# Altium schematic sheet Parasite.SchDoc: Magsound
size A2; Date: 2022/7/5; Author: Donghui Dai; CompanyName: Tagsys; DrawnBy: Donghui Dai; Engineer: Donghui Dai; Organization: Tagsys; DocumentNumber: 1; SheetNumber: 1; SheetTotal: 1; PageSetup: Record=PageOptions|CenterHorizontal=True|CenterVertical=True|PrintScale=0.64|XCorrection=1.00|YCorrection=1.00|PrintKind=0|BorderSize=5000000|LeftOffset=0|BottomOffset=0|Orientation=2|PaperLength=1000|PaperWidth=1000|Scale=100|PaperSource=15|PrintQuality=600|MediaType=1|DitherType=10|PrintScaleMode=1|PaperKind=Letter; CurrentTime: Not shown in title block; CurrentDate: Not shown in title block; DocumentFullPathAndName: Not shown in title block; DocumentName: Not shown in title block; ModifiedDate: Not shown in title block
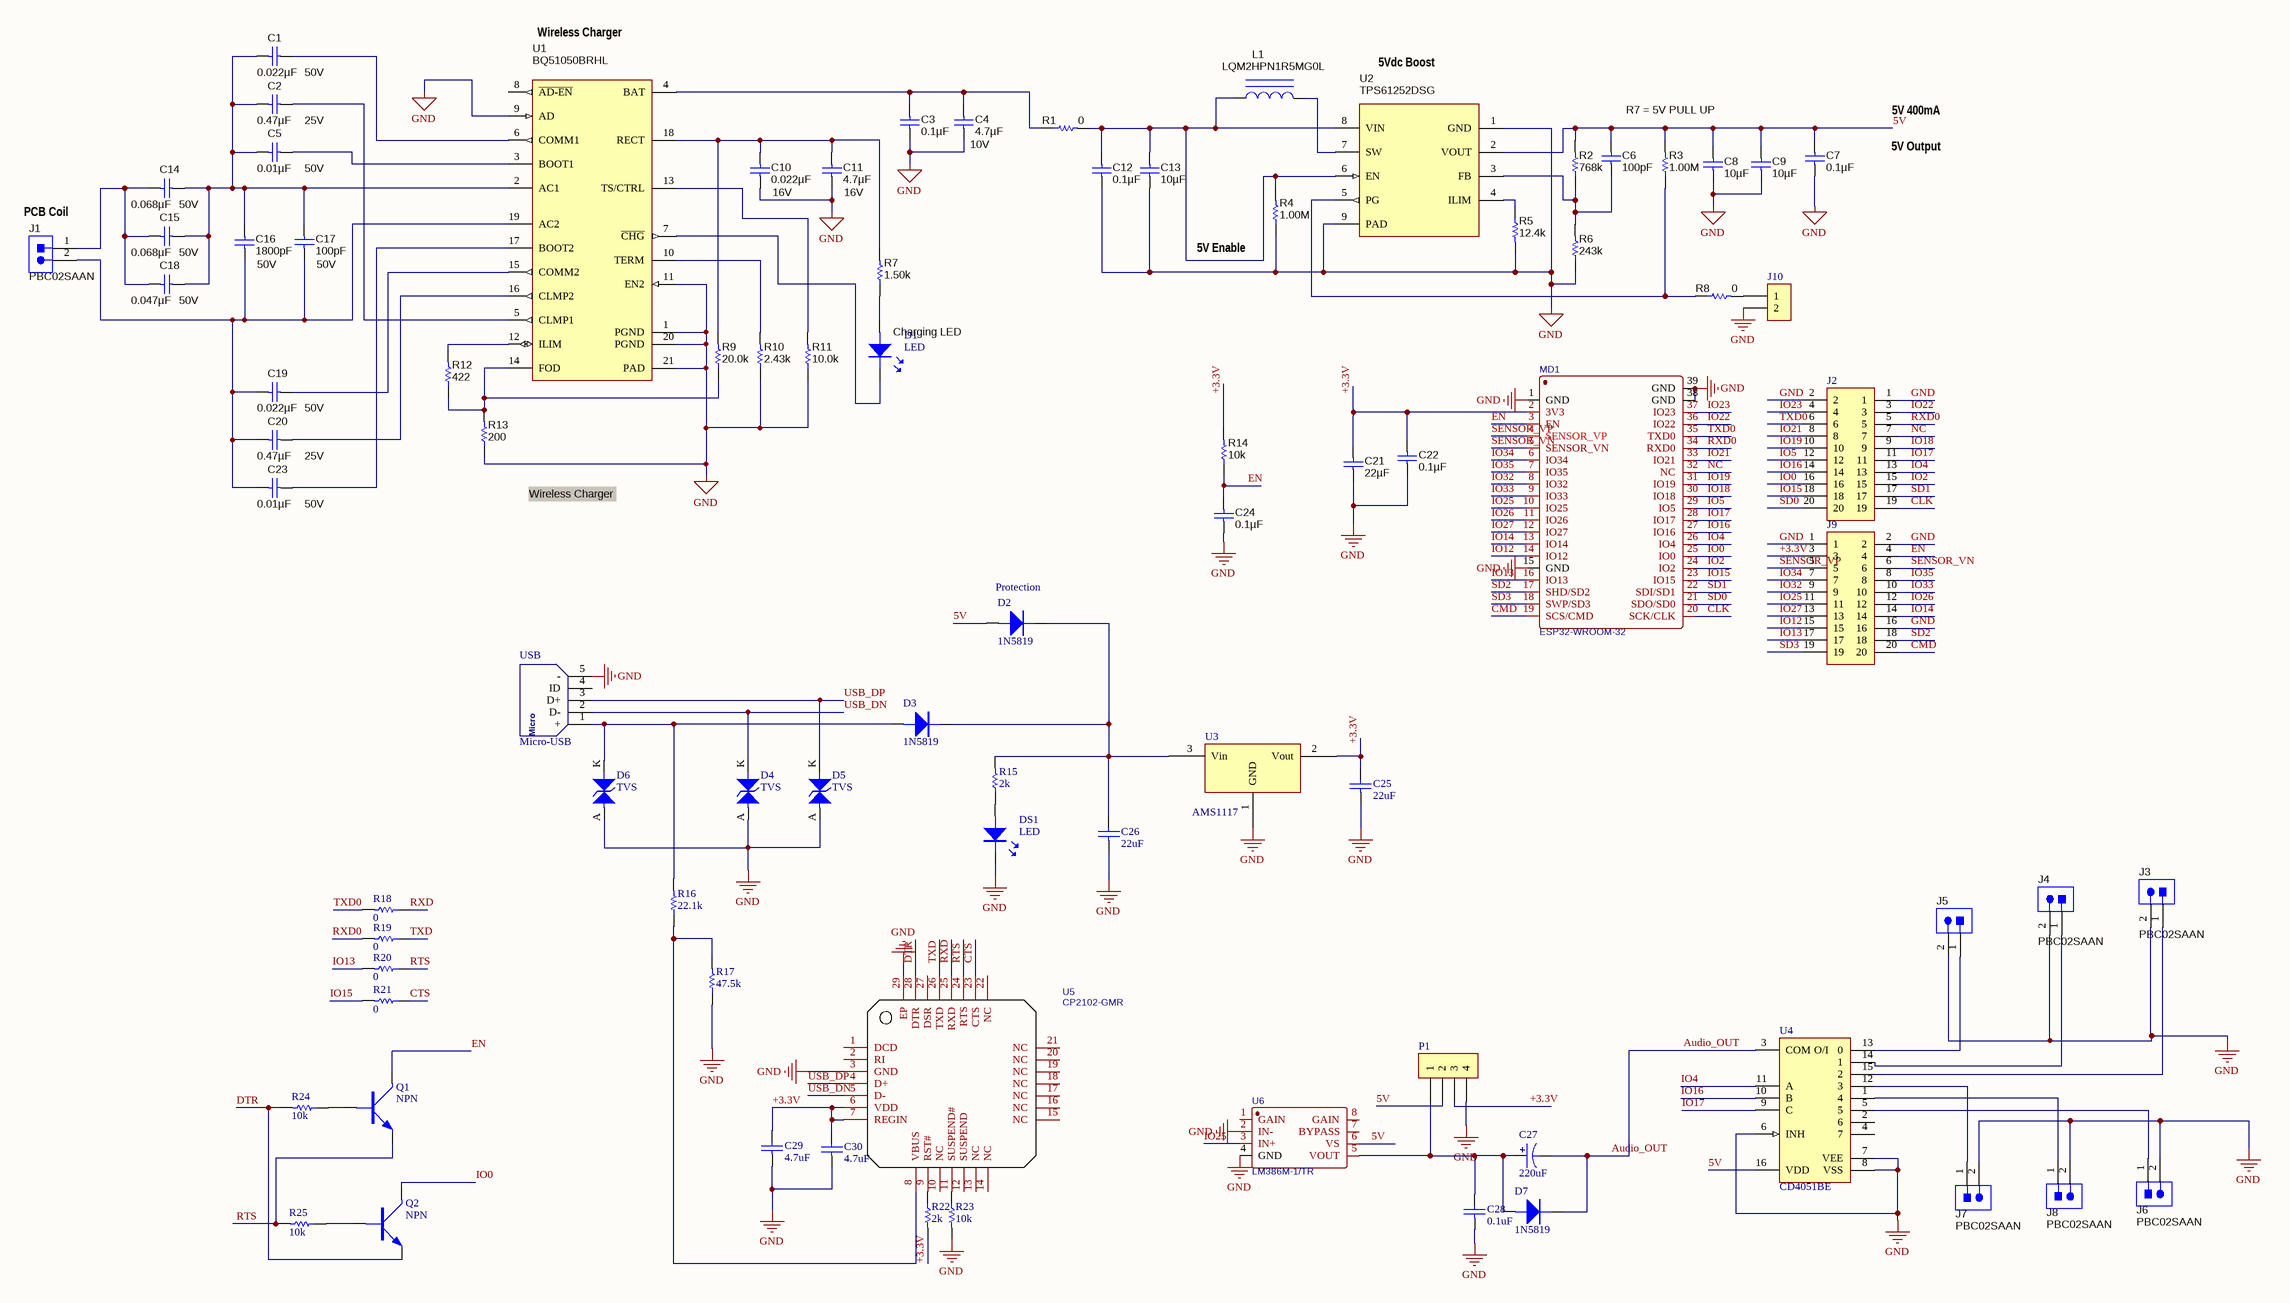
[diagram p0: Parasite.SchDoc]

## Parts
C1  ValueDisplayed: 0.022µF  Value2: 50V  [0603C]  (hidden comment: GRM155R71H223KA12D)
C2  ValueDisplayed: 0.47µF  Value2: 25V  [0603C]
C3  ValueDisplayed: 0.1µF  [0603C]  (hidden comment: GRM155R71A104KA01D)
C4  ValueDisplayed: 4.7µF  Value2: 10V  [0603C]  (hidden comment: C1005X5R1A475K050BC)
C5  ValueDisplayed: 0.01µF  Value2: 50V  [0603C]
C6  ValueDisplayed: 100pF  [0603C]  (hidden comment: CC0402JRNPO9BN101)
C7  ValueDisplayed: 0.1µF  [0603C]  (hidden comment: GRM155R71A104KA01D)
C8  ValueDisplayed: 10µF  [0603C]  (hidden comment: C0603C106M9PACTU)
C9  ValueDisplayed: 10µF  [0603C]  (hidden comment: C0603C106M9PACTU)
C10  ValueDisplayed: 0.022µF  Value2: 16V  [0603C]  (hidden comment: C1005X7R1C223K)
C11  ValueDisplayed: 4.7µF  Value2: 16V  [0603C]  (hidden comment: GRM188R61C475KAAJ)
C12  ValueDisplayed: 0.1µF  [0603C]  (hidden comment: GRM155R71A104KA01D)
C13  ValueDisplayed: 10µF  [0603C]  (hidden comment: C0603C106M9PACTU)
C14  ValueDisplayed: 0.068µF  Value2: 50V  [0603C]  (hidden comment: C1005X7R1H683K)
C15  ValueDisplayed: 0.068µF  Value2: 50V  [0603C]  (hidden comment: C1005X7R1H683K)
C16  ValueDisplayed: 1800pF  Value2: 50V  [0603C]  (hidden comment: GRM1885C1H182JA01D)
C17  ValueDisplayed: 100pF  Value2: 50V  [0603C]  (hidden comment: CC0402JRNPO9BN101)
C18  ValueDisplayed: 0.047µF  Value2: 50V  [0603C]  (hidden comment: GRM188R71H473KA61D)
C19  ValueDisplayed: 0.022µF  Value2: 50V  [0603C]  (hidden comment: GRM155R71H223KA12D)
C20  ValueDisplayed: 0.47µF  Value2: 25V  [0603C]  (hidden comment: GRM188R71E474KA12D)
C21  ValueDisplayed: 22µF  [0603C]  (hidden comment: GRM155R71A104KA01D)
C22  ValueDisplayed: 0.1µF  [0603C]  (hidden comment: GRM155R71A104KA01D)
C23  ValueDisplayed: 0.01µF  Value2: 50V  [0603C]  (hidden comment: C0402C103J5RACTU)
C24  ValueDisplayed: 0.1µF  [0603C]  (hidden comment: GRM155R71A104KA01D)
C25  22uF  [0603C]
C26  22uF  [0603C]
C27  220uF  [TAJ-B/3528]
C28  0.1uF  [0603C]
C29  4.7uF  [0603C]
C30  4.7uF  [0603C]
D1  LED  [LED-0603G]
D2  1N5819  [SOD-123]
D3  1N5819  [SOD-123]
D4  TVS  [SOD-523]
D5  TVS  [SOD-523]
D6  TVS  [SOD-523]
D7  1N5819  [SOD-123]
DS1  LED  [LED-0603B]
J1  PBC02SAAN  [Pin HDR1X2/2.54mm-S]
J2  (no value)  [Pin HDR2X10/2.54mm-S]
J3  PBC02SAAN  [Pin HDR1X2/2.54mm-S]
J4  PBC02SAAN  [Pin HDR1X2/2.54mm-S]
J5  (no value)  [Pin HDR1X2/2.54mm-S]
J6  PBC02SAAN  [Pin HDR1X2/2.54mm-S]
J7  PBC02SAAN  [Pin HDR1X2/2.54mm-S]
J8  PBC02SAAN  [Pin HDR1X2/2.54mm-S]
J9  (no value)  [Pin HDR2X10/2.54mm-S]
J10  (no value)  [Pin HDR1X2/2.54mm-S]
L1  LQM2HPN1R5MG0L  [L1008]
MD1  ESP32-WROOM-32  [WIFIM-SMD_ESP-32S]
P1  (no value)  [Pin HDR1X4/2.54mm-S]
Q1  NPN  [SOT-23]
Q2  NPN  [SOT-23]
R1  ValueDisplayed: 0  [0603R]  (hidden comment: CRCW04020000Z0ED)
R2  ValueDisplayed: 768k  [0603R]  (hidden comment: CRCW0402768KFKED)
R3  ValueDisplayed: 1.00M  [0603R]  (hidden comment: CRCW04021M00FKED)
R4  ValueDisplayed: 1.00M  [0603R]  (hidden comment: CRCW04021M00FKED)
R5  ValueDisplayed: 12.4k  [0603R]  (hidden comment: CRCW040212K4FKED)
R6  ValueDisplayed: 243k  [0603R]  (hidden comment: CRCW0402243KFKED)
R7  ValueDisplayed: 1.50k  [0603R]  (hidden comment: CRCW04021K50FKED)
R8  ValueDisplayed: 0  [0603R]  (hidden comment: CRCW04020000Z0ED)
R9  ValueDisplayed: 20.0k  [0603R]  (hidden comment: CRCW040220K0FKED)
R10  ValueDisplayed: 2.43k  [0603R]  (hidden comment: CRCW04022K43FKED)
R11  ValueDisplayed: 10.0k  [0603R]  (hidden comment: CRCW040210K0FKED)
R12  ValueDisplayed: 422  [0603R]
R13  ValueDisplayed: 200  [0603R]
R14  10k  [0603R]
R15  2k  [0603R]
R16  22.1k  [0603R]
R17  47.5k  [0603R]
R18  0  [0603R]
R19  0  [0603R]
R20  0  [0603R]
R21  0  [0603R]
R22  2k  [0603R]
R23  10k  [0603R]
R24  10k  [0603R]
R25  10k  [0603R]
U1  BQ51050BRHL  [QFN-20_L4.7-W3.7-P0.50-BL-EP]
U2  TPS61252DSG  [WSON-8_L2.0-W2.0-P0.65-BL-EP]
U3  AMS1117  [SOT223]
U4  CD4051BE  [DIP16]
U5  CP2102-GMR  [WQFN-28_L5.0-W5.0-P0.50-BL-EP3.2]
U6  LM386M-1/TR  [SOP-8_L5.0-W4.0-P1.27-LS6.0-BL]
USB  Micro-USB  [USB-micro_B]

## Nets
GND: C3.2 C4.2 C7.2 C8.2 C9.2 C10.2 C11.2 C12.2 C13.2 C21.2 C22.2 C24.2 C25.1 C26.1 C28.1 C29.1 C30.1 D4.A D5.A D6.A DS1.K J2.1 J2.2 J3.2 J4.2 J5.2 J6.2 J7.2 J8.2 J9.1 J9.2 J9.16 J10.2 MD1.1(GND) MD1.15(GND) MD1.38(GND) MD1.39(GND) P1.4 R4.1 R5.2 R6.1 R10.1 R11.1 R13.1 R17.1 R23.2 U1.1(PGND) U1.9(AD) U1.11(EN2) U1.20(PGND) U1.21(PAD) U2.1(GND) U2.9(PAD) U3.1(GND) U4.6(INH) U4.7(VEE) U4.8(VSS) U5.3(GND) U5.29(EP) U6.2(IN-) U6.4(GND) USB.5(-)
5V: C6.1 C7.1 C8.1 C9.1 D2.A P1.2 R2.2 R3.2 U2.2(VOUT) U4.16(VDD) U6.6(VS)
+3.3V: C21.1 C22.1 C25.2 C29.2 C30.2 J9.3 MD1.2(3V3) P1.3 R14.2 R22.2 U3.2(Vout) U5.6(VDD) U5.7(REGIN)
Audio_OUT: C27.2 D7.K U4.3(COM_O/I)
CLK: J2.19 MD1.20(SCK/CLK)
CMD: J9.20 MD1.19(SCS/CMD)
CTS: R21.1 U5.23(CTS)
DTR: Q2.E R24.2 U5.28(DTR)
EN: C24.1 J9.4 MD1.3(EN) Q1.C R14.1
IO0: J2.16 MD1.25(IO0) Q2.C
IO2: J2.15 MD1.24(IO2)
IO4: J2.13 MD1.26(IO4) U4.11(A)
IO5: J2.12 MD1.29(IO5)
IO12: J9.15 MD1.14(IO12)
IO13: J9.17 MD1.16(IO13) R20.2
IO14: J9.14 MD1.13(IO14)
IO15: J2.18 MD1.23(IO15) R21.2
IO16: J2.14 MD1.27(IO16) U4.10(B)
IO17: J2.11 MD1.28(IO17) U4.9(C)
IO18: J2.9 MD1.30(IO18)
IO19: J2.10 MD1.31(IO19)
IO21: J2.8 MD1.33(IO21)
IO22: J2.3 MD1.36(IO22)
IO23: J2.4 MD1.37(IO23)
IO25: J9.11 MD1.10(IO25) U6.3(IN+)
IO26: J9.12 MD1.11(IO26)
IO27: J9.13 MD1.12(IO27)
IO32: J9.9 MD1.8(IO32)
IO33: J9.10 MD1.9(IO33)
IO34: J9.7 MD1.6(IO34)
IO35: J9.8 MD1.7(IO35)
NC: J2.7 MD1.32(NC)
RTS: Q1.E R20.1 R25.2 U5.24(RTS)
RXD: R18.1 U5.25(RXD)
RXD0: J2.5 MD1.34(RXD0) R19.2
SD0: J2.20 MD1.21(SDO/SD0)
SD1: J2.17 MD1.22(SDI/SD1)
SD2: J9.18 MD1.17(SHD/SD2)
SD3: J9.19 MD1.18(SWP/SD3)
SENSOR_VN: J9.6 MD1.5(SENSOR_VN)
SENSOR_VP: J9.5 MD1.4(SENSOR_VP)
TXD: R19.1 U5.26(TXD)
TXD0: J2.6 MD1.35(TXD0) R18.2
USB_DN: D4.K U5.5(D-) USB.2(D-)
USB_DP: D5.K U5.4(D+) USB.3(D+)
NetC1_1: C1.1 U1.6(COMM1)
NetC1_2: C1.2 C2.2 C5.2 C14.1 C15.1 C16.1 C17.2 C18.1 U1.2(AC1)
NetC2_1: C2.1 U1.5(CLMP1)
NetC3_1: C3.1 C4.1 R1.1 U1.4(BAT)
NetC5_1: C5.1 U1.3(BOOT1)
NetC6_2: C6.2 R2.1 R6.2 U2.3(FB)
NetC10_1: C10.1 C11.1 R7.2 R9.2 U1.18(RECT)
NetC12_1: C12.1 C13.1 L1.1 R1.2 R4.2 U2.6(EN) U2.8(VIN)
NetC14_2: C14.2 C15.2 C18.2 J1.1
NetC16_2: C16.2 C17.1 C19.2 C20.2 C23.2 J1.2 U1.19(AC2)
NetC19_1: C19.1 U1.15(COMM2)
NetC20_1: C20.1 U1.16(CLMP2)
NetC23_1: C23.1 U1.17(BOOT2)
NetC26_2: C26.2 D2.K D3.K R15.2 U3.3(Vin)
NetC27_1: C27.1 C28.2 D7.A P1.1 U6.5(VOUT)
NetD1_A: D1.A R7.1
NetD1_K: D1.K U1.7(~{CHG})
NetD3_A: D3.A D6.K R16.2 USB.1(+)
NetDS1_A: DS1.A R15.1
NetJ3_1: J3.1 U4.15(2)
NetJ4_1: J4.1 U4.14(1)
NetJ5_1: J5.1 U4.13(0)
NetJ6_1: J6.1 U4.5
NetJ7_1: J7.1 U4.12(3)
NetJ8_1: J8.1 U4.1(4)
NetJ10_1: J10.1 R8.2
NetL1_2: L1.2 U2.7(SW)
NetQ1_B: Q1.B R24.1
NetQ2_B: Q2.B R25.1
NetR3_1: R3.1 R8.1 U2.5(PG)
NetR5_1: R5.1 U2.4(ILIM)
NetR9_1: R9.1 R12.1 R13.2 U1.14(FOD)
NetR10_2: R10.2 U1.10(TERM)
NetR11_2: R11.2 U1.13(TS/CTRL)
NetR12_2: R12.2 U1.12(ILIM)
NetR16_1: R16.1 R17.2 U5.8(VBUS)
NetR22_1: R22.1 U5.9(RST#)
NetR23_1: R23.1 U5.11(SUSPEND#)

Not connected (* = marked no-connect by the designer): U1 8(~{AD-EN}); U4 2(6) 4(7); U5 1(DCD) 2(RI) 10(NC) 12(SUSPEND) 13(NC) 14(NC) 15(NC) 16(NC) 17(NC) 18(NC) 19(NC) 20(NC) 21(NC) 22(NC) 27(DSR); U6 1(GAIN) 7(BYPASS) 8(GAIN); USB 4(ID)

## Notes on the sheet
- Wireless Charger
- 5Vdc Boost
- R7 = 5V PULL UP
- 5V Output
- 5V 400mA
- (near J1) PCB Coil
- (near R4) 5V Enable
- (near D1) Charging LED
- (near D2) Protection
- Title
- Size:
- Date:
- File:
- A2
- Number:
- Time:
- Revision:
- Sheet
- of
- (in symbol Micro-USB) Micro

## Library data of the parts
C1 C19 = GRM155R71H223KA12D: CAP, CERM, 0.022 µF, 50 V, +/- 10%, X7R, 0402; Manufacturer: MuRata; Polarized: N; CompType: Capacitor; Value: 0.022uF; U/M: EA; Cap_F: 0.000000022; Tolerance_%: 10; Value1: Unknown; VDC_V: 50; TaMin_C: -55; TaMax_C: 125; Cap_Case: 0402; SymbolVersion: 2008-07-09; PartNumber: GRM155R71H223KA12D; PackageReference: 0402; RoHS: Y; MountType: SMT; Technology: Ceramic; TempCo: X7R; Published: 2008-06-19; Publisher: Texas Instruments; LatestRevisionDate: 2015-07-30; ComponentLink1Description: Datasheet link; ComponentLink1URL: http://search.murata.co.jp/Ceramy/PnsearchViewAction.do?HnOFG=ON&HnNFG=ON&SEL_CNT=50&sLang=en&sKey=GRM155R71H223KA12D&x=9&y=9&search=startwith; Supplier 1: Digi-Key; Supplier Part Number 1: 490-3884-1-ND; Supplier 2: Mouser; Supplier Part Number 2: 81-GRM155R71H223KA12; Supplier 3: Farnell; Supplier Part Number 3: 1828888
C2 C20 = GRM188R71E474KA12D: CAP, CERM, 0.47 µF, 25 V, +/- 10%, X7R, 0603; Manufacturer: MuRata; Polarized: N; CompType: Capacitor; Value: 0.47uF; U/M: EA; Cap_F: 0.00000047; Tolerance_%: 10; Value1: Unknown; VDC_V: 25; TaMin_C: -55; TaMax_C: 125; Cap_Case: 0603; SymbolVersion: 2008-07-09; PartNumber: GRM188R71E474KA12D; PackageReference: 0603; RoHS: Y; MountType: SMT; Technology: Ceramic; TempCo: X7R; Published: 2008-06-19; Publisher: Texas Instruments; LatestRevisionDate: 2015-07-30; ComponentLink1Description: Datasheet link; ComponentLink1URL: http://search.murata.co.jp/Ceramy/PnsearchViewAction.do?HnOFG=ON&HnNFG=ON&SEL_CNT=50&sLang=en&sKey=GRM188R71E474KA12D&x=9&y=9&search=startwith; Supplier 1: Digi-Key; Supplier Part Number 1: 490-3291-1-ND; Supplier 2: Mouser; Supplier Part Number 2: 81-GRM188R71E474KA12; Supplier 3: Farnell; Supplier Part Number 3: 1828901
C3 C7 C12 C21 C22 C24 = GRM155R71A104KA01D: CAP, CERM, 0.1 µF, 10 V, +/- 10%, X7R, 0402; Manufacturer: MuRata; Polarized: N; CompType: Capacitor; Value: 0.1uF; U/M: EA; Cap_F: 0.0000001; Tolerance_%: 10; Value1: Unknown; Value2: 10V; TaMin_C: -55; TaMax_C: 125; Cap_Case: 0402; SymbolVersion: 2008-07-09; PartNumber: GRM155R71A104KA01D; PackageReference: 0402; RoHS: Y; VDC_V: 10; MountType: SMT; Technology: Ceramic; TempCo: X7R; Published: 2008-06-19; Publisher: Texas Instruments; LatestRevisionDate: 2015-07-30; ComponentLink1Description: Datasheet link; ComponentLink1URL: http://search.murata.co.jp/Ceramy/PnsearchViewAction.do?HnOFG=ON&HnNFG=ON&SEL_CNT=50&sLang=en&sKey=GRM155R71A104KA01D&x=9&y=9&search=startwith; Supplier 1: Digi-Key; Supplier Part Number 1: GRM155R71A104KA01D-ND; Supplier 2: Mouser; Supplier Part Number 2: 81-GRM155R71A104KA1D; Supplier 3: Farnell; Supplier Part Number 3: 1828860
C4 = C1005X5R1A475K050BC: CAP, CERM, 4.7 µF, 10 V, +/- 10%, X5R, 0402; Manufacturer: TDK; Polarized: N; CompType: Capacitor; Value: 4.7uF; U/M: EA; Cap_F: 0.0000047; Tolerance_%: 10; Value1: Unknown; TaMin_C: -55; TaMax_C: 85; Cap_Case: 0402; SymbolVersion: 2008-07-09; PartNumber: C1005X5R1A475K050BC; PackageReference: 0402; RoHS: Y; VDC_V: 10; MountType: SMT; Technology: Ceramic; TempCo: X5R; Published: 2008-06-19; Publisher: Texas Instruments; LatestRevisionDate: 2015-07-30; ComponentLink1Description: Datasheet link; ComponentLink1URL: http://product.tdk.com/en/catalog/datasheets/mlcc_commercial_general_en.pdf; Supplier 1: Digi-Key; Supplier Part Number 1: 445-13820-1-ND; Supplier 2: Mouser; Supplier Part Number 2: 810-C1005X5R1A475KBC
C5 C23 = C0402C103J5RACTU: CAP, CERM, 0.01 µF, 50 V, +/- 5%, X7R, 0402; Manufacturer: Kemet; Polarized: N; CompType: Capacitor; Value: 0.01uF; U/M: EA; Cap_F: 0.00000001; Tolerance_%: 5; Value1: Unknown; VDC_V: 50; TaMin_C: -55; TaMax_C: 125; Cap_Case: 0402; SymbolVersion: 2008-07-09; PartNumber: C0402C103J5RACTU; PackageReference: 0402; RoHS: Y; MountType: SMT; Technology: Ceramic; TempCo: X7R; Published: 2008-06-19; Publisher: Texas Instruments; LatestRevisionDate: 2015-07-30; ComponentLink1Description: Datasheet link; ComponentLink1URL: http://www.kemet.com/Lists/ProductCatalog/Attachments/53/KEM_C1002_X7R_SMD.pdf; Supplier 1: Digi-Key; Supplier Part Number 1: 399-7758-1-ND; Supplier 2: Mouser; Supplier Part Number 2: 80-C0402C103J5R; Supplier 3: Farnell; Supplier Part Number 3: 2413922
C6 = CC0402JRNPO9BN101: CAP, CERM, 100 pF, 50 V, +/- 5%, C0G/NP0, 0402; Manufacturer: Yageo America; Polarized: N; CompType: Capacitor; Value: 100pF; U/M: EA; Cap_F: 0.0000000001; Tolerance_%: 5; Value1: Unknown; VDC_V: 50; Value2: 50V; TaMin_C: -55; TaMax_C: 125; Cap_Case: 0402; SymbolVersion: 2008-07-09; PartNumber: CC0402JRNPO9BN101; PackageReference: 0402; RoHS: Y; MountType: SMT; Technology: Ceramic; TempCo: C0G/NP0; Published: 2008-06-19; Publisher: Texas Instruments; LatestRevisionDate: 2015-07-30; ComponentLink1Description: Datasheet link; ComponentLink1URL: http://www.yageo.com/documents/recent/UPY-GP_NP0_16V-to-50V_10.pdf; Supplier 1: Digi-Key; Supplier Part Number 1: 311-1024-1-ND; Supplier 2: Mouser; Supplier Part Number 2: 603-CC402JRNPO9BN101; Supplier 3: Farnell; Supplier Part Number 3: 3019226
C8 C9 C13 = C0603C106M9PACTU: CAP, CERM, 10 µF, 6.3 V, +/- 20%, X5R, 0603; Manufacturer: Kemet; Polarized: N; CompType: Capacitor; Value: 10uF; U/M: EA; Cap_F: 0.00001; Tolerance_%: 20; ESR_ohm: 0.004; Value1: 0.004 ohm; VDC_V: 6.3; Value2: 6.3V; IRMS_A: 8.9; TaMin_C: -55; TaMax_C: 85; Cap_Case: 0603; SymbolVersion: 2008-07-09; PartNumber: C0603C106M9PACTU; PackageReference: 0603; RoHS: Y; MountType: SMT; Technology: Ceramic; TempCo: X5R; Published: 2008-06-19; Publisher: Texas Instruments; LatestRevisionDate: 2015-07-30; ComponentLink1Description: Datasheet link; ComponentLink1URL: http://www.kemet.com/kemet/web/homepage/kechome.nsf/vapubfiles/F3102_Y5V.pdf/$file/F3102_Y5V.pdf; Supplier 1: Digi-Key; Supplier Part Number 1: 399-5504-1-ND; Supplier 2: Mouser; Supplier Part Number 2: 80-C0603C106M9P; Supplier 3: Farnell; Supplier Part Number 3: 1288201
C10 = C1005X7R1C223K: CAP, CERM, 0.022 µF, 16 V, +/- 10%, X7R, 0402; Manufacturer: TDK; Polarized: N; CompType: Capacitor; Value: 0.022uF; U/M: EA; Cap_F: 0.000000022; Tolerance_%: 10; ESR_ohm: 0.0419; Value1: 0.0419 ohm; VDC_V: 16; TaMin_C: -55; TaMax_C: 125; Cap_Case: 0402; SymbolVersion: 2008-07-09; PartNumber: C1005X7R1C223K; PackageReference: 0402; RoHS: Y; MountType: SMT; Technology: Ceramic; TempCo: X7R; Published: 2008-06-19; Publisher: Texas Instruments; LatestRevisionDate: 2015-07-30; ComponentLink1Description: Datasheet link; ComponentLink1URL: http://www.tdk.co.jp/tefe02/e412_c.pdf; Supplier 1: Digi-Key; Supplier Part Number 1: 445-1263-1-ND; Supplier 2: Farnell; Supplier Part Number 2: 1844128
C11 = GRM188R61C475KAAJ: CAP, CERM, 4.7 µF, 16 V, +/- 10%, X5R, 0603; Manufacturer: MuRata; Polarized: N; CompType: Capacitor; Value: 4.7uF; U/M: EA; Cap_F: 0.0000047; Tolerance_%: 10; Value1: Unknown; VDC_V: 16; TaMin_C: -55; TaMax_C: 85; Cap_Case: 0603; SymbolVersion: 2008-07-09; PartNumber: GRM188R61C475KAAJ; PackageReference: 0603; RoHS: Y; MountType: SMT; Technology: Ceramic; TempCo: X5R; Published: 2008-06-19; Publisher: Texas Instruments; LatestRevisionDate: 2015-07-30; ComponentLink1Description: Datasheet link; ComponentLink1URL: http://psearch.murata.com/capacitor/product/GRM188R61C475KAAJ%23.pdf
C14 C15 = C1005X7R1H683K: CAP, CERM, 0.068 µF, 50 V, +/- 10%, X7R, 0402; Manufacturer: TDK; Polarized: N; CompType: Capacitor; Value: 0.068uF; U/M: EA; Cap_F: 0.000000068; Tolerance_%: 10; Value1: Unknown; VDC_V: 50; TaMin_C: -55; TaMax_C: 125; Cap_Case: 0402; SymbolVersion: 2008-07-09; PartNumber: C1005X7R1H683K; PackageReference: 0402; RoHS: Y; MountType: SMT; Technology: Ceramic; TempCo: X7R; Published: 2008-06-19; Publisher: Texas Instruments; LatestRevisionDate: 2015-07-30; ComponentLink1Description: Datasheet link; Supplier 1: Digi-Key; Supplier Part Number 1: 445-5930-1-ND; Supplier 2: Farnell; Supplier Part Number 2: 1844144
C16 = GRM1885C1H182JA01D: CAP, CERM, 1800 pF, 50 V, +/- 5%, C0G/NP0, 0603; Manufacturer: MuRata; Polarized: N; CompType: Capacitor; Value: 1800pF; U/M: EA; Cap_F: 0.0000000018; Tolerance_%: 5; Value1: Unknown; VDC_V: 50; TaMin_C: -55; TaMax_C: 125; Cap_Case: 0603; SymbolVersion: 2008-07-09; PartNumber: GRM1885C1H182JA01D; PackageReference: 0603; RoHS: Y; MountType: SMT; Technology: Ceramic; TempCo: C0G/NP0; Published: 2008-06-19; Publisher: Texas Instruments; LatestRevisionDate: 2015-07-30; ComponentLink1Description: Datasheet link; ComponentLink1URL: http://search.murata.co.jp/Ceramy/PnsearchViewAction.do?HnOFG=ON&HnNFG=ON&SEL_CNT=50&sLang=en&sKey=GRM1885C1H182JA01D&x=9&y=9&search=startwith; Supplier 1: Digi-Key; Supplier Part Number 1: 490-1457-1-ND; Supplier 2: Mouser; Supplier Part Number 2: 81-GRM1885C1H182JA01
C17 = CC0402JRNPO9BN101: CAP, CERM, 100 pF, 50 V, +/- 5%, C0G/NP0, 0402; Manufacturer: Yageo America; Polarized: N; CompType: Capacitor; Value: 100pF; U/M: EA; Cap_F: 0.0000000001; Tolerance_%: 5; Value1: Unknown; VDC_V: 50; TaMin_C: -55; TaMax_C: 125; Cap_Case: 0402; SymbolVersion: 2008-07-09; PartNumber: CC0402JRNPO9BN101; PackageReference: 0402; RoHS: Y; MountType: SMT; Technology: Ceramic; TempCo: C0G/NP0; Published: 2008-06-19; Publisher: Texas Instruments; LatestRevisionDate: 2015-07-30; ComponentLink1Description: Datasheet link; ComponentLink1URL: http://www.yageo.com/documents/recent/UPY-GP_NP0_16V-to-50V_10.pdf; Supplier 1: Digi-Key; Supplier Part Number 1: 311-1024-1-ND; Supplier 2: Mouser; Supplier Part Number 2: 603-CC402JRNPO9BN101; Supplier 3: Farnell; Supplier Part Number 3: 3019226
C18 = GRM188R71H473KA61D: CAP, CERM, 0.047 µF, 50 V, +/- 10%, X7R, 0603; Manufacturer: MuRata; Polarized: N; CompType: Capacitor; Value: 0.047uF; U/M: EA; Cap_F: 0.000000047; Tolerance_%: 10; Value1: Unknown; VDC_V: 50; TaMin_C: -55; TaMax_C: 125; Cap_Case: 0603; SymbolVersion: 2008-07-09; PartNumber: GRM188R71H473KA61D; PackageReference: 0603; RoHS: Y; MountType: SMT; Technology: Ceramic; TempCo: X7R; Published: 2008-06-19; Publisher: Texas Instruments; LatestRevisionDate: 2015-07-30; ComponentLink1Description: Datasheet link; ComponentLink1URL: http://search.murata.co.jp/Ceramy/PnsearchViewAction.do?HnOFG=ON&HnNFG=ON&SEL_CNT=50&sLang=en&sKey=GRM188R71H473KA61D&x=9&y=9&search=startwith; Supplier 1: Digi-Key; Supplier Part Number 1: 490-3287-1-ND; Supplier 2: Mouser; Supplier Part Number 2: 81-GRM188R71H473KA61; Supplier 3: Farnell; Supplier Part Number 3: 8820015
C25 C26 C28-C30 = CAP: 无极性电容
C27 = TCAP: 钽电容
D2 D3 D7 = DIODE: 普通二极管
D4-D6 = TVS: 双向瞬态抑制二极管
J1 J3-J8 = PBC02SAAN: Header, 100mil, 2x1, Gold, TH; Manufacturer: Sullins Connector Solutions; SymbolCreator: a0412235; U/M: EA; SymbolVersion: 2013-10-31; PartNumber: PBC02SAAN; PackageReference: Sullins 100mil, 1x2, 230 mil above insulator; ClassName: Header; CompType: Header; RoHS: Y; MountType: TH; ComponentLink1Description: Datasheet Link; ComponentLink1URL: http://www.sullinscorp.com/catalogs/97_Page78-79_HEADER_.100_2.54mm_MALE_BREAKAWAY.pdf; Publisher: Texas Instruments; LatestRevisionDate: 2015-07-24; Supplier 1: Digi-Key; Supplier Part Number 1: S1011E-02-ND
J2 J9 = Pin HDR2X10
J10 = Pin HDR1X2
L1 = LQM2HPN1R5MG0L: Inductor, Multilayer, Ferrite, 1.5 µH, 1.5 A, 0.07 ohm, SMD; Manufacturer: MuRata; Value: 1.5uH; Ind_H: 1.5E-6; ValueDisplayed: 1.5µH; Imax_A: 1.5; Irms: 1.5A @ 40C rise; DCR_ohm: 0.07; Value2: 1.5A; SymbolVersion: 2008-07-23; CompType: Inductor; PartNumber: LQM2HPN1R5MG0L; Value1: 0.07 ohm; Technology: Multilayer; MountType: SMT; Material: Ferrite; PackageReference: SMD, Body 2.5x2mm, Height 1.2mm; Published: 2008-06-26; Publisher: Texas Instruments; LatestRevisionDate: 2015-07-10; ComponentLink1Description: Datasheet link; ComponentLink1URL: http://psearch.murata.com/inductor/product/LQM2HPN1R5MG0%23.pdf; RoHS: Y; Supplier 1: Digi-Key; Supplier Part Number 1: 490-5113-1-ND; Supplier 2: Mouser; Supplier Part Number 2: 81-LQM2HPN1R5MG0L
MD1 = ESP32-WROOM-32: BOM_Manufacturer: Espressif Systems; Contributor: LCSC; BOM_Supplier: LCSC; BOM_Supplier Part: C82899; BOM_Manufacturer Part: ESP32-WROOM-32; BOM_JLCPCB Part Class: Extended Part; spicePre: U; spiceSymbolName: ESP32-WROOM-32
P1 = Pin HDR1X4
Q1 Q2 = NPN: NPN三极管
R1 R8 = CRCW04020000Z0ED: RES, 0, 5%, 0.063 W, 0402; Manufacturer: Vishay-Dale; CompType: Resistor; Value: 0; Value_Code: 0000; Tolerance_%: 5; Power_W: 0.063; Value2: 0.063W; VDC_V: 50; TempCo: 200 ppm/C; EIA_Code: E24; U/M: EA; SymbolVersion: 2009-05-29; PartNumber: CRCW04020000Z0ED; PackageReference: 0402; RoHS: Y; Res_ohm: 0; Value1: 5%; MountType: SMT; Technology: Thick Film; Published: 2008-06-26; Publisher: Texas Instruments; LatestRevisionDate: 2015-07-29; ComponentLink1Description: Datasheet link; ComponentLink1URL: http://www.vishay.com/docs/20035/dcrcwe3.pdf; Supplier 1: Digi-Key; Supplier Part Number 1: 541-0.0JCT-ND; Supplier 2: Mouser; Supplier Part Number 2: 71-CRCW0402-0-E3; Supplier 3: Farnell; Supplier Part Number 3: 1469661
R2 = CRCW0402768KFKED: RES, 768 k, 1%, 0.063 W, 0402; Manufacturer: Vishay-Dale; CompType: Resistor; Value: 768k; Res_ohm: 768000; Tolerance_%: 1; Power_W: 0.063; Value2: 0.063W; VDC_V: 50; TempCo: 100 ppm/C; EIA_Code: E96; U/M: EA; SymbolVersion: 2009-05-29; PartNumber: CRCW0402768KFKED; PackageReference: 0402; RoHS: Y; Value_Code: 768k; Value1: 1%; MountType: SMT; Technology: Thick Film; Published: 2008-06-26; Publisher: Texas Instruments; LatestRevisionDate: 2015-07-29; ComponentLink1Description: Datasheet link; ComponentLink1URL: http://www.vishay.com/docs/20035/dcrcwe3.pdf; Supplier 1: Digi-Key; Supplier Part Number 1: 541-768KLCT-ND; Supplier 2: Mouser; Supplier Part Number 2: 71-CRCW0402768KFKED; Supplier 3: Farnell; Supplier Part Number 3: 1151495
R3 R4 R14 = CRCW04021M00FKED: RES, 1.00 M, 1%, 0.063 W, 0402; Manufacturer: Vishay-Dale; CompType: Resistor; Value: 1.00Meg; Res_ohm: 1000000; Value_Code: 1M00; Tolerance_%: 1; Power_W: 0.063; Value2: 0.063W; VDC_V: 50; TempCo: 100 ppm/C; EIA_Code: E96; U/M: EA; SymbolVersion: 2009-05-29; PartNumber: CRCW04021M00FKED; PackageReference: 0402; RoHS: Y; Value1: 1%; MountType: SMT; Technology: Thick Film; Published: 2008-06-26; Publisher: Texas Instruments; LatestRevisionDate: 2015-07-29; ComponentLink1Description: Datasheet link; ComponentLink1URL: http://www.vishay.com/docs/20035/dcrcwe3.pdf; Supplier 1: Digi-Key; Supplier Part Number 1: 541-1.00MLCT-ND; Supplier 2: Mouser; Supplier Part Number 2: 71-CRCW0402-1.0M-E3; Supplier 3: Farnell; Supplier Part Number 3: 1469667
  R14: ValueDisplayed: 10k
R5 = CRCW040212K4FKED: RES, 12.4 k, 1%, 0.063 W, 0402; Manufacturer: Vishay-Dale; CompType: Resistor; Value: 12.4k; Res_ohm: 12400; Value_Code: 12k4; Tolerance_%: 1; Power_W: 0.063; Value2: 0.063W; VDC_V: 50; TempCo: 100 ppm/C; EIA_Code: E96; U/M: EA; SymbolVersion: 2009-05-29; PartNumber: CRCW040212K4FKED; PackageReference: 0402; RoHS: Y; Value1: 1%; MountType: SMT; Technology: Thick Film; Published: 2008-06-26; Publisher: Texas Instruments; LatestRevisionDate: 2015-07-29; ComponentLink1Description: Datasheet link; ComponentLink1URL: http://www.vishay.com/docs/20035/dcrcwe3.pdf; Supplier 1: Digi-Key; Supplier Part Number 1: 541-12.4KLCT-ND; Supplier 2: Mouser; Supplier Part Number 2: 71-CRCW0402-12.4K-E3; Supplier 3: Farnell; Supplier Part Number 3: 1652748
R6 = CRCW0402243KFKED: RES, 243 k, 1%, 0.063 W, 0402; Manufacturer: Vishay-Dale; CompType: Resistor; Value: 243k; Res_ohm: 243000; Tolerance_%: 1; Power_W: 0.063; Value2: 0.063W; VDC_V: 50; TempCo: 100 ppm/C; EIA_Code: E96; U/M: EA; SymbolVersion: 2009-05-29; PartNumber: CRCW0402243KFKED; PackageReference: 0402; RoHS: Y; Value_Code: 243k; Value1: 1%; MountType: SMT; Technology: Thick Film; Published: 2008-06-26; Publisher: Texas Instruments; LatestRevisionDate: 2015-07-29; ComponentLink1Description: Datasheet link; ComponentLink1URL: http://www.vishay.com/docs/20035/dcrcwe3.pdf; Supplier 1: Digi-Key; Supplier Part Number 1: 541-243KLCT-ND; Supplier 2: Mouser; Supplier Part Number 2: 71-CRCW0402-243K-E3; Supplier 3: Farnell; Supplier Part Number 3: 1151064
R7 = CRCW04021K50FKED: RES, 1.50 k, 1%, 0.063 W, 0402; Manufacturer: Vishay-Dale; CompType: Resistor; Value: 1.50k; Res_ohm: 1500; Value_Code: 1k50; Tolerance_%: 1; Power_W: 0.063; Value2: 0.063W; VDC_V: 50; TempCo: 100 ppm/C; EIA_Code: E96; U/M: EA; SymbolVersion: 2009-05-29; PartNumber: CRCW04021K50FKED; PackageReference: 0402; RoHS: Y; Value1: 1%; MountType: SMT; Technology: Thick Film; Published: 2008-06-26; Publisher: Texas Instruments; LatestRevisionDate: 2015-07-29; ComponentLink1Description: Datasheet link; ComponentLink1URL: http://www.vishay.com/docs/20035/dcrcwe3.pdf; Supplier 1: Digi-Key; Supplier Part Number 1: 541-1.50KLCT-ND; Supplier 2: Mouser; Supplier Part Number 2: 71-CRCW0402-1.5K-E3; Supplier 3: Farnell; Supplier Part Number 3: 1653201
R9 = CRCW040220K0FKED: RES, 20.0 k, 1%, 0.063 W, 0402; Manufacturer: Vishay-Dale; CompType: Resistor; Value: 20.0k; Res_ohm: 20000; Value_Code: 20k0; Tolerance_%: 1; Power_W: 0.063; Value2: 0.063W; VDC_V: 50; TempCo: 100 ppm/C; EIA_Code: E96; U/M: EA; SymbolVersion: 2009-05-29; PartNumber: CRCW040220K0FKED; PackageReference: 0402; RoHS: Y; Value1: 1%; MountType: SMT; Technology: Thick Film; Published: 2008-06-26; Publisher: Texas Instruments; LatestRevisionDate: 2015-02-16; ComponentLink1Description: Datasheet link; ComponentLink1URL: http://www.vishay.com/docs/20035/dcrcwe3.pdf; Supplier 1: Digi-Key; Supplier Part Number 1: 541-20.0KLCT-ND; Supplier 2: Mouser; Supplier Part Number 2: 71-CRCW0402-20K-E3; Supplier 3: Farnell; Supplier Part Number 3: 1469693
R10 = CRCW04022K43FKED: RES, 2.43 k, 1%, 0.063 W, 0402; Manufacturer: Vishay-Dale; CompType: Resistor; Value: 2.43k; Res_ohm: 2430; Value_Code: 2k43; Tolerance_%: 1; Power_W: 0.063; Value2: 0.063W; VDC_V: 50; TempCo: 100 ppm/C; EIA_Code: E96; U/M: EA; SymbolVersion: 2009-05-29; PartNumber: CRCW04022K43FKED; PackageReference: 0402; RoHS: Y; Value1: 1%; MountType: SMT; Technology: Thick Film; Published: 2008-06-26; Publisher: Texas Instruments; LatestRevisionDate: 2015-07-29; ComponentLink1Description: Datasheet link; ComponentLink1URL: http://www.vishay.com/docs/20035/dcrcwe3.pdf; Supplier 1: Digi-Key; Supplier Part Number 1: 541-2.43KLCT-ND; Supplier 2: Mouser; Supplier Part Number 2: 71-CRCW0402-2.43K-E3; Supplier 3: Farnell; Supplier Part Number 3: 1652779
R11 = CRCW040210K0FKED: RES, 10.0 k, 1%, 0.063 W, 0402; Manufacturer: Vishay-Dale; CompType: Resistor; Value: 10.0k; Res_ohm: 10000; Value_Code: 10k0; Tolerance_%: 1; Power_W: 0.063; Value2: 0.063W; VDC_V: 50; TempCo: 100 ppm/C; EIA_Code: E96; U/M: EA; SymbolVersion: 2009-05-29; PartNumber: CRCW040210K0FKED; PackageReference: 0402; RoHS: Y; Value1: 1%; MountType: SMT; Technology: Thick Film; Published: 2008-06-26; Publisher: Texas Instruments; LatestRevisionDate: 2015-07-29; ComponentLink1Description: Datasheet link; ComponentLink1URL: http://www.vishay.com/docs/20035/dcrcwe3.pdf; Supplier 1: Digi-Key; Supplier Part Number 1: 541-10.0KLCT-ND; Supplier 2: Mouser; Supplier Part Number 2: 71-CRCW0402-10K-E3; Supplier 3: Farnell; Supplier Part Number 3: 1469669
R12 = CRCW0402422RFKED: RES, 422, 1%, 0.063 W, 0402; Manufacturer: Vishay-Dale; CompType: Resistor; Value: 422; Value_Code: 422R; Tolerance_%: 1; Power_W: 0.063; Value2: 0.063W; VDC_V: 50; TempCo: 100 ppm/C; EIA_Code: E96; U/M: EA; AEC Category: Q200; SymbolVersion: 2009-05-29; PartNumber: CRCW0402422RFKED; PackageReference: 0402; RoHS: Y; Res_ohm: 422; Value1: 1%; MountType: SMT; Technology: Thick Film; Published: 2008-06-26; Publisher: Texas Instruments; LatestRevisionDate: 2015-08-22; ComponentLink1Description: Datasheet link; ComponentLink1URL: http://www.vishay.com/docs/20035/dcrcwe3.pdf; Supplier 1: Digi-Key; Supplier Part Number 1: 541-422LCT-ND; Supplier 2: Mouser; Supplier Part Number 2: 71-CRCW0402-422-E3; Supplier 3: Farnell; Supplier Part Number 3: 1151270; AEC Qualified: ?
R13 = CRCW0402200RFKED: RES, 200, 1%, 0.063 W, 0402; Manufacturer: Vishay-Dale; CompType: Resistor; Value: 200; Value_Code: 200R; Tolerance_%: 1; Power_W: 0.063; Value2: 0.063W; VDC_V: 50; TempCo: 100 ppm/C; EIA_Code: E96; U/M: EA; AEC Category: Q200; SymbolVersion: 2009-05-29; PartNumber: CRCW0402200RFKED; PackageReference: 0402; RoHS: Y; Res_ohm: 200; Value1: 1%; MountType: SMT; Technology: Thick Film; Published: 2008-06-26; Publisher: Texas Instruments; LatestRevisionDate: 2015-08-22; ComponentLink1Description: Datasheet link; ComponentLink1URL: http://www.vishay.com/docs/20035/dcrcwe3.pdf; Supplier 1: Digi-Key; Supplier Part Number 1: 541-200LCT-ND; Supplier 2: Mouser; Supplier Part Number 2: 71-CRCW0402-200-E3; Supplier 3: Farnell; Supplier Part Number 3: 1469695; AEC Qualified: ?
R15-R25 = RES
U1 = BQ51050BRHL: High-Efficiency Qi v1.1-Compliant Wireless Power Receiver and Battery Charger, RHL0020A; Manufacturer: Texas Instruments; SymbolCreator: a0411947; CompType: IC; U/M: EA; SymbolVersion: 2014-03-12; PartNumber: BQ51050BRHL; PackageReference: RHL0020A; MountType: SMT; ComponentLink1Description: Datasheet Link; ComponentLink1URL: http://www.ti.com/lit/ds/symlink/bq51050b.pdf; RoHS: Y; Publisher: Texas Instruments; LatestRevisionDate: 2015-08-05; Alternate Manufacturer: Texas Instruments
U2 = TPS61252DSG: TINY 1.5-A BOOST CONVERTER WITH ADJUSTABLE INPUT CURRENT LIMIT, DSG0008A; Manufacturer: Texas Instruments; SymbolCreator: a0799628; CompType: IC; U/M: EA; SymbolVersion: 2013-11-21; PartNumber: TPS61252DSG; PackageReference: DSG0008A; MountType: SMT; ComponentLink1Description: Datasheet Link; ComponentLink1URL: http://www.ti.com/lit/ds/symlink/tps61252.pdf; RoHS: Y; Publisher: Texas Instruments; LatestRevisionDate: 2015-08-05; Alternate Manufacturer: Texas Instruments
U3 = AMS1117: 三端稳压芯片
U4 = CMP-1575-00059-4: CMOS Single 8-Channel Analog Multiplexer/Demultiplexer with Logic-Level Conversion, N0016A, TUBE; Manufacturer: Texas Instruments; VCC(Max)(V): 18; ICC(Typ)(mA): 0.00008; Output Drive (IOL/IOH)(Max)(mA): 1; Bandwidth(Max)(MHz): 20; Rating: Military; VCC(Min)(V): 5; Configuration: 1 X 1：8 MUX; Crosstalk: Yes; Ron(Max)(Ohms): 240; Ron(Typ)(Ohms): 125; DatasheetVersion: SCHS047G; Output Type: CMOS; PackageVersion: http://www.ti.com/lit/ml/mpdi002c/mpdi002c.pdf; Operating Temperature Range(C): -55 to 125; Generic Part Number: CD4051B; PackageReference: N0016A; Code_JEDEC: MS-001
U5 = CP2102-GMR: BOM_Manufacturer: SILICON LABS; BOM_Supplier: LCSC; BOM_Manufacturer Part: CP2102-GMR; BOM_Supplier Part: C6568; BOM_JLCPCB Part Class: Basic Part; spicePre: U; spiceSymbolName: CP2102-GMR
U6 = LM386M-1/TR: BOM_Manufacturer: HGSEMI; Contributor: LCSC; BOM_Supplier: LCSC; BOM_Supplier Part: C383071; BOM_Manufacturer Part: LM386M-1/TR; BOM_JLCPCB Part Class: Extended Part; spicePre: U; spiceSymbolName: LM386M-1/TR